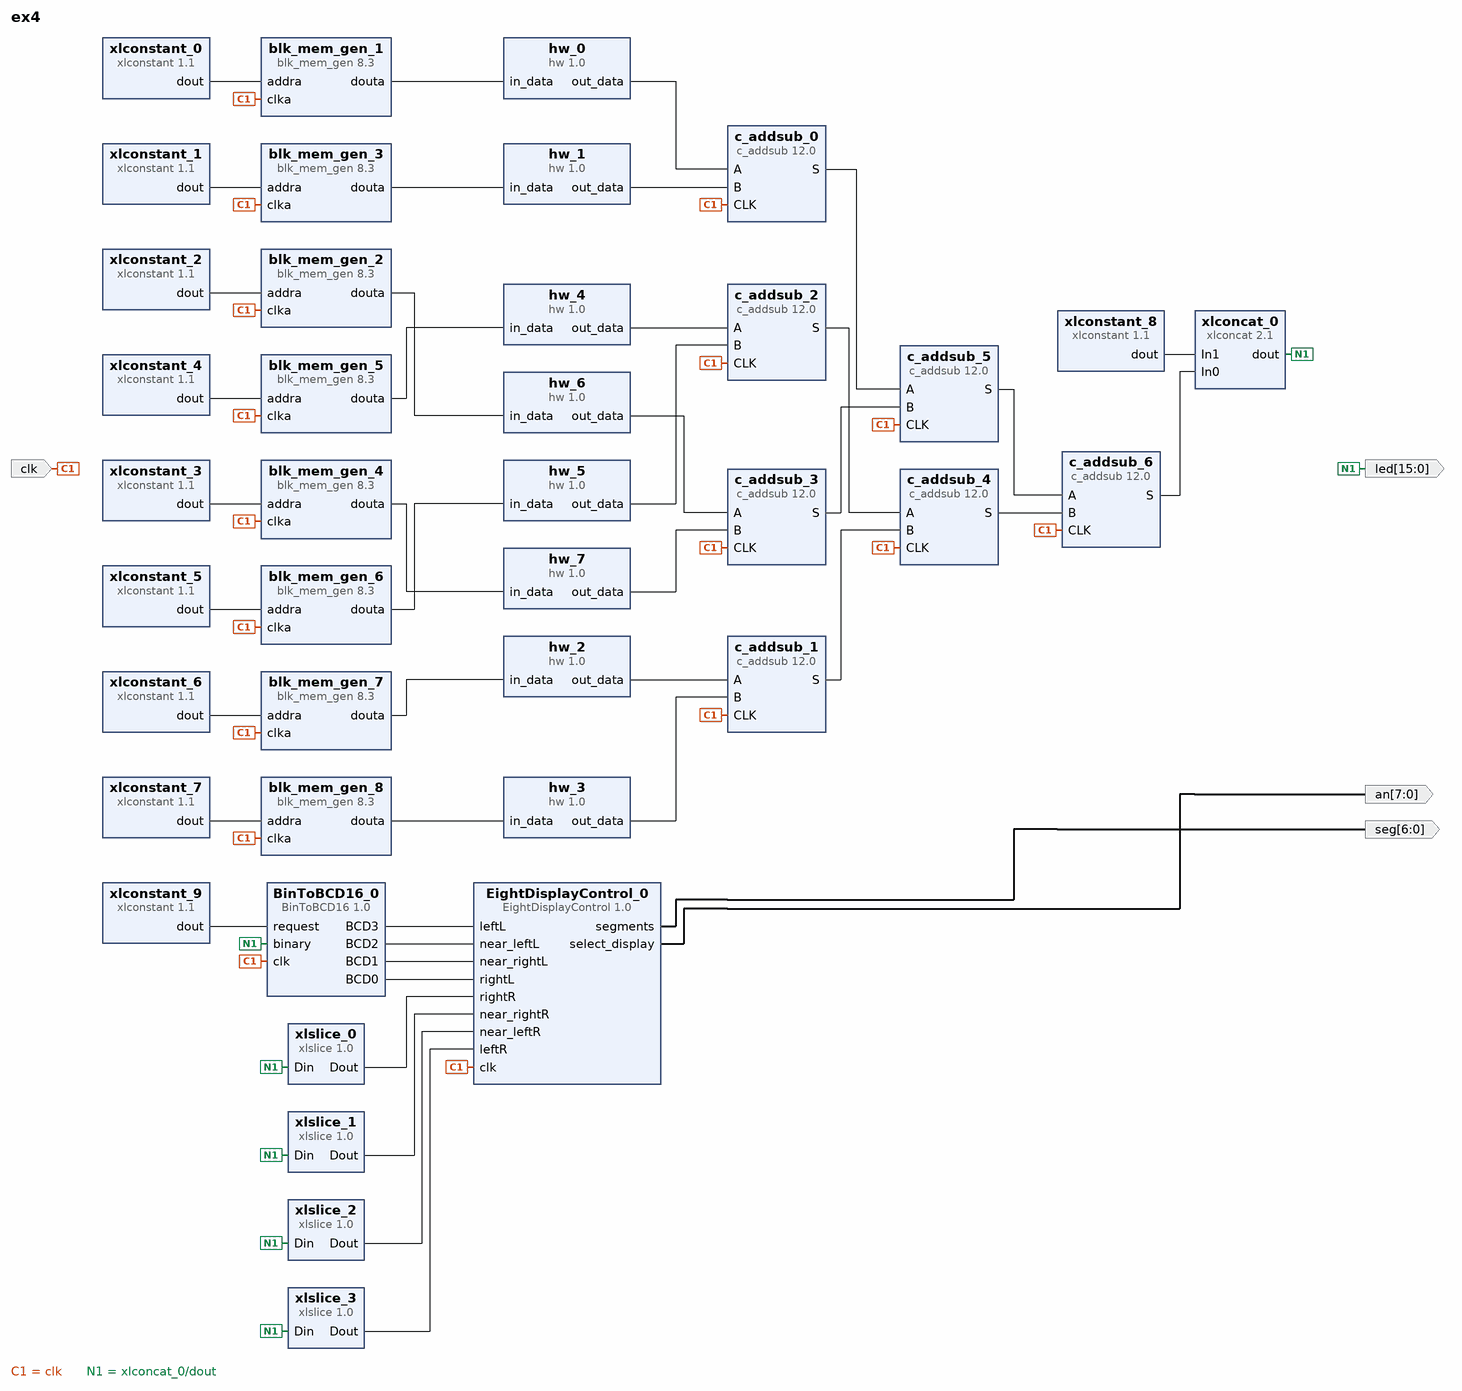
[diagram p0: block diagram of the top level]
# Vivado block design ex4, Vivado 2015.4
create_bd_design ex4

create_bd_port -dir I clk
create_bd_port -dir O -from 7 -to 0 an
create_bd_port -dir O -from 6 -to 0 seg
create_bd_port -dir O -from 15 -to 0 led

create_bd_cell -type ip -vlnv xilinx.com:ip:blk_mem_gen:8.3 blk_mem_gen_1
set_property -dict [list \
  CONFIG.Memory_Type Single_Port_ROM \
  CONFIG.Enable_32bit_Address false \
  CONFIG.Write_Width_A 16 \
  CONFIG.Write_Depth_A 8 \
  CONFIG.Enable_A Always_Enabled \
  CONFIG.Register_PortA_Output_of_Memory_Primitives true \
  CONFIG.Load_Init_File true \
  CONFIG.Coe_File ../../../../imports/Projects2016/8words_16bits.coe \
  CONFIG.Use_RSTA_Pin false \
  CONFIG.Port_A_Write_Rate 0 \
  CONFIG.use_bram_block Stand_Alone \
] [get_bd_cells blk_mem_gen_1]
create_bd_cell -type ip -vlnv xilinx.com:ip:xlconstant:1.1 xlconstant_0
set_property -dict {CONFIG.CONST_WIDTH 3 CONFIG.CONST_VAL 0} [get_bd_cells xlconstant_0]
create_bd_cell -type ip -vlnv xilinx.com:ip:blk_mem_gen:8.3 blk_mem_gen_2
set_property -dict [list \
  CONFIG.Memory_Type Single_Port_ROM \
  CONFIG.Enable_32bit_Address false \
  CONFIG.Write_Width_A 16 \
  CONFIG.Write_Depth_A 8 \
  CONFIG.Enable_A Always_Enabled \
  CONFIG.Register_PortA_Output_of_Memory_Primitives true \
  CONFIG.Load_Init_File true \
  CONFIG.Coe_File ../../../../imports/Projects2016/8words_16bits.coe \
  CONFIG.Use_RSTA_Pin false \
  CONFIG.Port_A_Write_Rate 0 \
  CONFIG.use_bram_block Stand_Alone \
] [get_bd_cells blk_mem_gen_2]
create_bd_cell -type ip -vlnv xilinx.com:ip:blk_mem_gen:8.3 blk_mem_gen_3
set_property -dict [list \
  CONFIG.Memory_Type Single_Port_ROM \
  CONFIG.Enable_32bit_Address false \
  CONFIG.Write_Width_A 16 \
  CONFIG.Write_Depth_A 8 \
  CONFIG.Enable_A Always_Enabled \
  CONFIG.Register_PortA_Output_of_Memory_Primitives true \
  CONFIG.Load_Init_File true \
  CONFIG.Coe_File ../../../../imports/Projects2016/8words_16bits.coe \
  CONFIG.Use_RSTA_Pin false \
  CONFIG.Port_A_Write_Rate 0 \
  CONFIG.use_bram_block Stand_Alone \
] [get_bd_cells blk_mem_gen_3]
create_bd_cell -type ip -vlnv xilinx.com:ip:blk_mem_gen:8.3 blk_mem_gen_4
set_property -dict [list \
  CONFIG.Memory_Type Single_Port_ROM \
  CONFIG.Enable_32bit_Address false \
  CONFIG.Write_Width_A 16 \
  CONFIG.Write_Depth_A 8 \
  CONFIG.Enable_A Always_Enabled \
  CONFIG.Register_PortA_Output_of_Memory_Primitives true \
  CONFIG.Load_Init_File true \
  CONFIG.Coe_File ../../../../imports/Projects2016/8words_16bits.coe \
  CONFIG.Use_RSTA_Pin false \
  CONFIG.Port_A_Write_Rate 0 \
  CONFIG.use_bram_block Stand_Alone \
] [get_bd_cells blk_mem_gen_4]
create_bd_cell -type ip -vlnv xilinx.com:ip:blk_mem_gen:8.3 blk_mem_gen_5
set_property -dict [list \
  CONFIG.Memory_Type Single_Port_ROM \
  CONFIG.Enable_32bit_Address false \
  CONFIG.Write_Width_A 16 \
  CONFIG.Write_Depth_A 8 \
  CONFIG.Enable_A Always_Enabled \
  CONFIG.Register_PortA_Output_of_Memory_Primitives true \
  CONFIG.Load_Init_File true \
  CONFIG.Coe_File ../../../../imports/Projects2016/8words_16bits.coe \
  CONFIG.Use_RSTA_Pin false \
  CONFIG.Port_A_Write_Rate 0 \
  CONFIG.use_bram_block Stand_Alone \
] [get_bd_cells blk_mem_gen_5]
create_bd_cell -type ip -vlnv xilinx.com:ip:blk_mem_gen:8.3 blk_mem_gen_6
set_property -dict [list \
  CONFIG.Memory_Type Single_Port_ROM \
  CONFIG.Enable_32bit_Address false \
  CONFIG.Write_Width_A 16 \
  CONFIG.Write_Depth_A 8 \
  CONFIG.Enable_A Always_Enabled \
  CONFIG.Register_PortA_Output_of_Memory_Primitives true \
  CONFIG.Load_Init_File true \
  CONFIG.Coe_File ../../../../imports/Projects2016/8words_16bits.coe \
  CONFIG.Use_RSTA_Pin false \
  CONFIG.Port_A_Write_Rate 0 \
  CONFIG.use_bram_block Stand_Alone \
] [get_bd_cells blk_mem_gen_6]
create_bd_cell -type ip -vlnv xilinx.com:ip:blk_mem_gen:8.3 blk_mem_gen_7
set_property -dict [list \
  CONFIG.Memory_Type Single_Port_ROM \
  CONFIG.Enable_32bit_Address false \
  CONFIG.Write_Width_A 16 \
  CONFIG.Write_Depth_A 8 \
  CONFIG.Enable_A Always_Enabled \
  CONFIG.Register_PortA_Output_of_Memory_Primitives true \
  CONFIG.Load_Init_File true \
  CONFIG.Coe_File ../../../../imports/Projects2016/8words_16bits.coe \
  CONFIG.Use_RSTA_Pin false \
  CONFIG.Port_A_Write_Rate 0 \
  CONFIG.use_bram_block Stand_Alone \
] [get_bd_cells blk_mem_gen_7]
create_bd_cell -type ip -vlnv xilinx.com:ip:blk_mem_gen:8.3 blk_mem_gen_8
set_property -dict [list \
  CONFIG.Memory_Type Single_Port_ROM \
  CONFIG.Enable_32bit_Address false \
  CONFIG.Write_Width_A 16 \
  CONFIG.Write_Depth_A 8 \
  CONFIG.Enable_A Always_Enabled \
  CONFIG.Register_PortA_Output_of_Memory_Primitives true \
  CONFIG.Load_Init_File true \
  CONFIG.Coe_File ../../../../imports/Projects2016/8words_16bits.coe \
  CONFIG.Use_RSTA_Pin false \
  CONFIG.Port_A_Write_Rate 0 \
  CONFIG.use_bram_block Stand_Alone \
] [get_bd_cells blk_mem_gen_8]
create_bd_cell -type ip -vlnv xilinx.com:ip:xlconstant:1.1 xlconstant_1
set_property -dict {CONFIG.CONST_WIDTH 3 CONFIG.CONST_VAL 2} [get_bd_cells xlconstant_1]
create_bd_cell -type ip -vlnv xilinx.com:ip:xlconstant:1.1 xlconstant_2
set_property -dict {CONFIG.CONST_WIDTH 3 CONFIG.CONST_VAL 1} [get_bd_cells xlconstant_2]
create_bd_cell -type ip -vlnv xilinx.com:ip:xlconstant:1.1 xlconstant_3
set_property -dict {CONFIG.CONST_WIDTH 3 CONFIG.CONST_VAL 3} [get_bd_cells xlconstant_3]
create_bd_cell -type ip -vlnv xilinx.com:ip:xlconstant:1.1 xlconstant_4
set_property -dict {CONFIG.CONST_WIDTH 3 CONFIG.CONST_VAL 4} [get_bd_cells xlconstant_4]
create_bd_cell -type ip -vlnv xilinx.com:ip:xlconstant:1.1 xlconstant_5
set_property -dict {CONFIG.CONST_WIDTH 3 CONFIG.CONST_VAL 5} [get_bd_cells xlconstant_5]
create_bd_cell -type ip -vlnv xilinx.com:ip:xlconstant:1.1 xlconstant_6
set_property -dict {CONFIG.CONST_WIDTH 3 CONFIG.CONST_VAL 6} [get_bd_cells xlconstant_6]
create_bd_cell -type ip -vlnv xilinx.com:ip:xlconstant:1.1 xlconstant_7
set_property -dict {CONFIG.CONST_WIDTH 3 CONFIG.CONST_VAL 7} [get_bd_cells xlconstant_7]
create_bd_cell -type ip -vlnv user.org:user:hw:1.0 hw_0
create_bd_cell -type ip -vlnv user.org:user:hw:1.0 hw_1
create_bd_cell -type ip -vlnv user.org:user:hw:1.0 hw_2
create_bd_cell -type ip -vlnv user.org:user:hw:1.0 hw_3
create_bd_cell -type ip -vlnv user.org:user:hw:1.0 hw_4
create_bd_cell -type ip -vlnv user.org:user:hw:1.0 hw_5
create_bd_cell -type ip -vlnv user.org:user:hw:1.0 hw_6
create_bd_cell -type ip -vlnv user.org:user:hw:1.0 hw_7
create_bd_cell -type ip -vlnv xilinx.com:ip:c_addsub:12.0 c_addsub_0
set_property -dict [list \
  CONFIG.A_Type Unsigned \
  CONFIG.B_Type Unsigned \
  CONFIG.A_Width 5 \
  CONFIG.B_Width 5 \
  CONFIG.Out_Width 6 \
  CONFIG.Latency_Configuration Automatic \
  CONFIG.Latency 1 \
  CONFIG.B_Constant false \
  CONFIG.B_Value 00000 \
  CONFIG.CE false \
] [get_bd_cells c_addsub_0]
create_bd_cell -type ip -vlnv xilinx.com:ip:c_addsub:12.0 c_addsub_1
set_property -dict [list \
  CONFIG.A_Type Unsigned \
  CONFIG.B_Type Unsigned \
  CONFIG.A_Width 5 \
  CONFIG.B_Width 5 \
  CONFIG.Out_Width 6 \
  CONFIG.Latency_Configuration Automatic \
  CONFIG.Latency 1 \
  CONFIG.B_Constant false \
  CONFIG.B_Value 00000 \
  CONFIG.CE false \
] [get_bd_cells c_addsub_1]
create_bd_cell -type ip -vlnv xilinx.com:ip:c_addsub:12.0 c_addsub_2
set_property -dict [list \
  CONFIG.A_Type Unsigned \
  CONFIG.B_Type Unsigned \
  CONFIG.A_Width 5 \
  CONFIG.B_Width 5 \
  CONFIG.Out_Width 6 \
  CONFIG.Latency_Configuration Automatic \
  CONFIG.Latency 1 \
  CONFIG.B_Constant false \
  CONFIG.B_Value 00000 \
  CONFIG.CE false \
] [get_bd_cells c_addsub_2]
create_bd_cell -type ip -vlnv xilinx.com:ip:c_addsub:12.0 c_addsub_3
set_property -dict [list \
  CONFIG.A_Type Unsigned \
  CONFIG.B_Type Unsigned \
  CONFIG.A_Width 5 \
  CONFIG.B_Width 5 \
  CONFIG.Out_Width 6 \
  CONFIG.Latency_Configuration Automatic \
  CONFIG.Latency 1 \
  CONFIG.B_Constant false \
  CONFIG.B_Value 00000 \
  CONFIG.CE false \
] [get_bd_cells c_addsub_3]
create_bd_cell -type ip -vlnv xilinx.com:ip:c_addsub:12.0 c_addsub_4
set_property -dict [list \
  CONFIG.A_Type Unsigned \
  CONFIG.B_Type Unsigned \
  CONFIG.A_Width 6 \
  CONFIG.B_Width 6 \
  CONFIG.Out_Width 7 \
  CONFIG.Latency_Configuration Automatic \
  CONFIG.Latency 1 \
  CONFIG.B_Constant false \
  CONFIG.B_Value 000000 \
  CONFIG.CE false \
] [get_bd_cells c_addsub_4]
create_bd_cell -type ip -vlnv xilinx.com:ip:c_addsub:12.0 c_addsub_5
set_property -dict [list \
  CONFIG.A_Type Unsigned \
  CONFIG.B_Type Unsigned \
  CONFIG.A_Width 6 \
  CONFIG.B_Width 6 \
  CONFIG.Out_Width 7 \
  CONFIG.Latency_Configuration Automatic \
  CONFIG.Latency 1 \
  CONFIG.B_Constant false \
  CONFIG.B_Value 000000 \
  CONFIG.CE false \
] [get_bd_cells c_addsub_5]
create_bd_cell -type ip -vlnv xilinx.com:ip:c_addsub:12.0 c_addsub_6
set_property -dict [list \
  CONFIG.A_Type Unsigned \
  CONFIG.B_Type Unsigned \
  CONFIG.A_Width 7 \
  CONFIG.B_Width 7 \
  CONFIG.Out_Width 8 \
  CONFIG.Latency_Configuration Automatic \
  CONFIG.Latency 1 \
  CONFIG.B_Constant false \
  CONFIG.B_Value 0000000 \
  CONFIG.CE false \
] [get_bd_cells c_addsub_6]
create_bd_cell -type ip -vlnv xilinx.com:ip:xlconcat:2.1 xlconcat_0
set_property -dict {CONFIG.IN0_WIDTH 8 CONFIG.IN1_WIDTH 8} [get_bd_cells xlconcat_0]
create_bd_cell -type ip -vlnv xilinx.com:ip:xlconstant:1.1 xlconstant_8
set_property -dict {CONFIG.CONST_WIDTH 8 CONFIG.CONST_VAL 0} [get_bd_cells xlconstant_8]
create_bd_cell -type ip -vlnv ua.pt:user:BinToBCD16:1.0 BinToBCD16_0
create_bd_cell -type ip -vlnv ua.pt:user:EightDisplayControl:1.0 EightDisplayControl_0
create_bd_cell -type ip -vlnv xilinx.com:ip:xlconstant:1.1 xlconstant_9
create_bd_cell -type ip -vlnv xilinx.com:ip:xlslice:1.0 xlslice_0
set_property -dict {CONFIG.DOUT_WIDTH 4 CONFIG.DIN_TO 0 CONFIG.DIN_FROM 3 CONFIG.DIN_WIDTH 16} [get_bd_cells xlslice_0]
create_bd_cell -type ip -vlnv xilinx.com:ip:xlslice:1.0 xlslice_1
set_property -dict {CONFIG.DOUT_WIDTH 4 CONFIG.DIN_TO 4 CONFIG.DIN_FROM 7 CONFIG.DIN_WIDTH 16} [get_bd_cells xlslice_1]
create_bd_cell -type ip -vlnv xilinx.com:ip:xlslice:1.0 xlslice_2
set_property -dict {CONFIG.DOUT_WIDTH 4 CONFIG.DIN_TO 8 CONFIG.DIN_FROM 11 CONFIG.DIN_WIDTH 16} [get_bd_cells xlslice_2]
create_bd_cell -type ip -vlnv xilinx.com:ip:xlslice:1.0 xlslice_3
set_property -dict {CONFIG.DOUT_WIDTH 4 CONFIG.DIN_TO 12 CONFIG.DIN_FROM 15 CONFIG.DIN_WIDTH 16} [get_bd_cells xlslice_3]

# ---- connections ----

connect_bd_net [get_bd_ports clk] \
  [get_bd_pins blk_mem_gen_1/clka] [get_bd_pins blk_mem_gen_3/clka] [get_bd_pins blk_mem_gen_2/clka] \
  [get_bd_pins blk_mem_gen_4/clka] [get_bd_pins blk_mem_gen_5/clka] [get_bd_pins blk_mem_gen_6/clka] \
  [get_bd_pins blk_mem_gen_7/clka] [get_bd_pins blk_mem_gen_8/clka] [get_bd_pins c_addsub_1/CLK] [get_bd_pins c_addsub_2/CLK] \
  [get_bd_pins c_addsub_3/CLK] [get_bd_pins c_addsub_4/CLK] [get_bd_pins c_addsub_5/CLK] [get_bd_pins c_addsub_6/CLK] \
  [get_bd_pins c_addsub_0/CLK] [get_bd_pins BinToBCD16_0/clk] [get_bd_pins EightDisplayControl_0/clk]
connect_bd_net [get_bd_pins xlconstant_0/dout] [get_bd_pins blk_mem_gen_1/addra]
connect_bd_net [get_bd_pins xlconstant_1/dout] [get_bd_pins blk_mem_gen_3/addra]
connect_bd_net [get_bd_pins xlconstant_2/dout] [get_bd_pins blk_mem_gen_2/addra]
connect_bd_net [get_bd_pins xlconstant_3/dout] [get_bd_pins blk_mem_gen_4/addra]
connect_bd_net [get_bd_pins xlconstant_4/dout] [get_bd_pins blk_mem_gen_5/addra]
connect_bd_net [get_bd_pins xlconstant_5/dout] [get_bd_pins blk_mem_gen_6/addra]
connect_bd_net [get_bd_pins xlconstant_6/dout] [get_bd_pins blk_mem_gen_7/addra]
connect_bd_net [get_bd_pins xlconstant_7/dout] [get_bd_pins blk_mem_gen_8/addra]
connect_bd_net [get_bd_pins blk_mem_gen_1/douta] [get_bd_pins hw_0/in_data]
connect_bd_net [get_bd_pins blk_mem_gen_3/douta] [get_bd_pins hw_1/in_data]
connect_bd_net [get_bd_pins blk_mem_gen_8/douta] [get_bd_pins hw_3/in_data]
connect_bd_net [get_bd_pins blk_mem_gen_7/douta] [get_bd_pins hw_2/in_data]
connect_bd_net [get_bd_pins blk_mem_gen_6/douta] [get_bd_pins hw_5/in_data]
connect_bd_net [get_bd_pins blk_mem_gen_5/douta] [get_bd_pins hw_4/in_data]
connect_bd_net [get_bd_pins blk_mem_gen_2/douta] [get_bd_pins hw_6/in_data]
connect_bd_net [get_bd_pins blk_mem_gen_4/douta] [get_bd_pins hw_7/in_data]
connect_bd_net [get_bd_pins hw_0/out_data] [get_bd_pins c_addsub_0/A]
connect_bd_net [get_bd_pins hw_1/out_data] [get_bd_pins c_addsub_0/B]
connect_bd_net [get_bd_pins hw_3/out_data] [get_bd_pins c_addsub_1/B]
connect_bd_net [get_bd_pins hw_2/out_data] [get_bd_pins c_addsub_1/A]
connect_bd_net [get_bd_pins hw_4/out_data] [get_bd_pins c_addsub_2/A]
connect_bd_net [get_bd_pins hw_5/out_data] [get_bd_pins c_addsub_2/B]
connect_bd_net [get_bd_pins hw_6/out_data] [get_bd_pins c_addsub_3/A]
connect_bd_net [get_bd_pins hw_7/out_data] [get_bd_pins c_addsub_3/B]
connect_bd_net [get_bd_pins c_addsub_1/S] [get_bd_pins c_addsub_4/B]
connect_bd_net [get_bd_pins c_addsub_2/S] [get_bd_pins c_addsub_4/A]
connect_bd_net [get_bd_pins c_addsub_3/S] [get_bd_pins c_addsub_5/B]
connect_bd_net [get_bd_pins c_addsub_0/S] [get_bd_pins c_addsub_5/A]
connect_bd_net [get_bd_pins c_addsub_5/S] [get_bd_pins c_addsub_6/A]
connect_bd_net [get_bd_pins c_addsub_4/S] [get_bd_pins c_addsub_6/B]
connect_bd_net [get_bd_pins xlconstant_8/dout] [get_bd_pins xlconcat_0/In1]
connect_bd_net [get_bd_pins xlconcat_0/dout] \
  [get_bd_pins BinToBCD16_0/binary] [get_bd_ports led] [get_bd_pins xlslice_0/Din] [get_bd_pins xlslice_1/Din] \
  [get_bd_pins xlslice_2/Din] [get_bd_pins xlslice_3/Din]
connect_bd_net [get_bd_pins xlconstant_9/dout] [get_bd_pins BinToBCD16_0/request]
connect_bd_net [get_bd_pins EightDisplayControl_0/segments] [get_bd_ports seg]
connect_bd_net [get_bd_pins EightDisplayControl_0/select_display] [get_bd_ports an]
connect_bd_net [get_bd_pins BinToBCD16_0/BCD3] [get_bd_pins EightDisplayControl_0/leftL]
connect_bd_net [get_bd_pins BinToBCD16_0/BCD2] [get_bd_pins EightDisplayControl_0/near_leftL]
connect_bd_net [get_bd_pins BinToBCD16_0/BCD1] [get_bd_pins EightDisplayControl_0/near_rightL]
connect_bd_net [get_bd_pins BinToBCD16_0/BCD0] [get_bd_pins EightDisplayControl_0/rightL]
connect_bd_net [get_bd_pins c_addsub_6/S] [get_bd_pins xlconcat_0/In0]
connect_bd_net [get_bd_pins xlslice_0/Dout] [get_bd_pins EightDisplayControl_0/rightR]
connect_bd_net [get_bd_pins xlslice_1/Dout] [get_bd_pins EightDisplayControl_0/near_rightR]
connect_bd_net [get_bd_pins xlslice_2/Dout] [get_bd_pins EightDisplayControl_0/near_leftR]
connect_bd_net [get_bd_pins xlslice_3/Dout] [get_bd_pins EightDisplayControl_0/leftR]

validate_bd_design
save_bd_design
